# Altium project буй_2_0_AA.PrjPcb
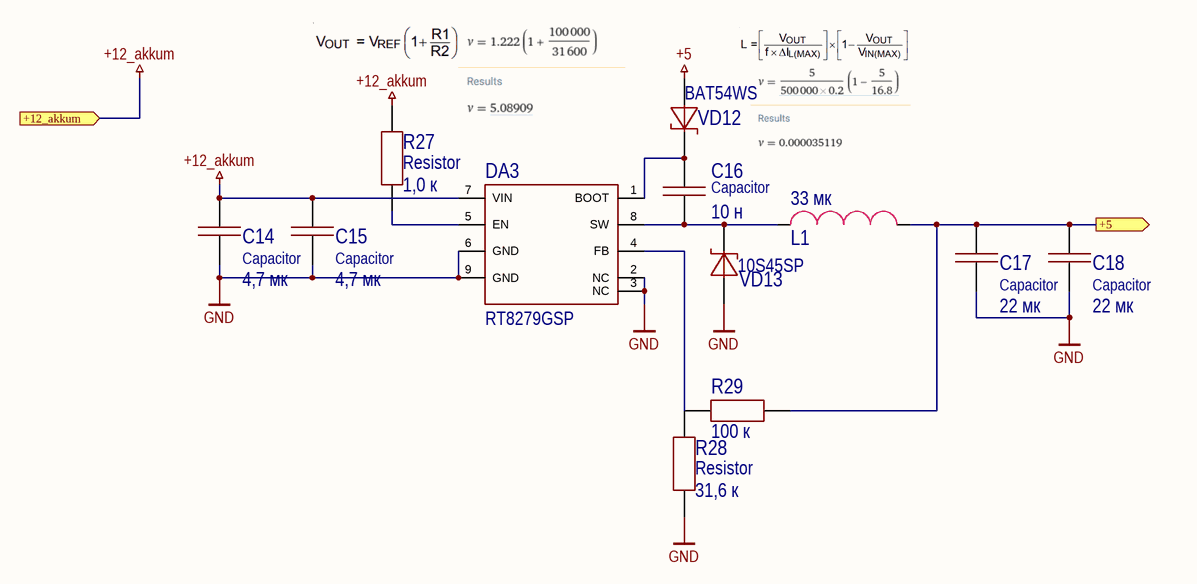
[diagram p0: dcdc5v.SchDoc]
5 sheets, 67 parts. Net scope: flat (ports and power ports of the same name join across sheets).
Board files: áóåêòîïîëãèÿ.PcbDoc, â2áóåêÿèãîëîï.PcbDoc
Sheets:
  dcdc5v.SchDoc
  jarit'_paneli.SchDoc
  switch.SchDoc
  dcdc_na_akkum.SchDoc
  sepic12-12.SchDoc

## Sheet dcdc5v.SchDoc
size A3; Organization: Yandex; Address2: 11 Timura Frunze st., building 2; Release_Date: yyyy-mm-dd; Language: en; Organization2: Self Driving Group LLC

### Parts
C14  Capacitor  value 4,7 мк  [1206C]
C15  Capacitor  value 4,7 мк  [1206C]
C16  Capacitor  value 10 н  [0603C]
C17  Capacitor  value 22 мк  [1210C]
C18  Capacitor  value 22 мк  [1210C]
DA3  RT8279GSP  [8SOP(Exposed_Pad)]
L1  value 33 мк  [IHLP-4040]  (hidden comment: IHLP4040DZER330M11)
R27  Resistor  value 1,0 к  [0603R]
R28  Resistor  value 31,6 к  [0603R]
R29  value 100 к  [0603R]  (hidden comment: Resistor)
VD12  BAT54WS  [SOD-323]
VD13  10S45SP  [TO-277]

### Ports
+5 (out), +12_akkum (in)

### Nets
+5: VD12.1
+12_akkum: C14.2 C15.2 DA3.7(VIN) R27.2 ; port +12_akkum
GND: C14.1 C15.1 C17.1 C18.1 DA3.2(NC) DA3.3(NC) DA3.6(GND) DA3.9(GND) R28.1 VD13.1
NetC16_1: C16.1 DA3.8(SW) L1.1 VD13.2
NetC16_2: C16.2 DA3.1(BOOT) VD12.2
NetC17_2: C17.2 C18.2 L1.2 R29.2 ; port +5
NetDA3_4: DA3.4(FB) R28.2 R29.1
NetDA3_5: DA3.5(EN) R27.1

### Notes on the sheet
- 1
- 2
- 3
- 4
- 5
- 6
- 7
- 8
- A
- B
- C
- D
- E
- Responsible department
- Technical reference
- Document type
- Document status
- F
- Legal owner
- Created by
- Schematic drawing
- Title, Supplementary title
- CONFIDENTIAL
- Yandex
- Commercial secret
- Self Driving Group LLC
- Approved by
- Doc Rev.
- Date of Issue
- Lang.
- Sheet
- A3

### Library data of the parts
C14 C15 = Capacitor_4,7u_10_50V_X7R_1206C: Конденсатор; Tolerance: 0,1; Voltage (V): 50; Dielectric: X7R; Capacity (nF): 4700; Part Number: Capacitor_4,7u_10_50V_X7R_1206C
C16 = Capacitor_10n_10_50V_X7R_0603C: Конденсатор; Tolerance: 0,1; Voltage (V): 50; Dielectric: X7R; Capacity (nF): 10; Part Number: Capacitor_10n_10_50V_X7R_0603C
C17 C18 = Capacitor_22u_10_25V_X7R_1210C: Конденсатор; Tolerance: 0,1; Voltage (V): 25; Dielectric: X7R; Capacity (nF): 22000; Part Number: Capacitor_22u_10_25V_X7R_1210C
DA3 = RT8279GSP: Преобразователь постоянного тока понижающий подстраиваемый выход 5А; Part Number: RT8279GSP
L1 = IHLP4040DZER330M11: ЧИП-индуктивность экранированная 33мкГн ±20% 4,4A 94,5мОм 4040; Inductance (μH): 33; Current (A): 4,4; Part Number: IHLP4040DZER330M11
R27 = Resistor_1.0k_1_0603: Резистор номиналом 1,0 кОм и точностью 1%; Power: *; Part Number: Resistor_1.0k_1_0603; Tolerance: 1%
R28 = Resistor_31.6k_1_0603: Резистор номиналом 31,6 кОм и точностью 1%; Power: *; Part Number: Resistor_31.6k_1_0603; Tolerance: 1%
R29 = Resistor_100k_1_0603: Резистор номиналом 100 кОм и точностью 1%; Power: *; Part Number: Resistor_100k_1_0603; Tolerance: 1%
VD12 = BAT54WS: Диод шоттки на 30 В, ном. ток 0.2 А; Voltage nominal (V): 30; Current (A): 0.2; Part Number: BAT54WS
VD13 = 10S45SP: Диод шоттки на 45 В, ном. ток 10 А; Voltage nominal (V): 45; Current (A): 10; Part Number: 10S45SP

## Sheet jarit'_paneli.SchDoc
size A3; Organization: Yandex; Address2: 11 Timura Frunze st., building 2; Release_Date: yyyy-mm-dd; Language: en; Organization2: Self Driving Group LLC
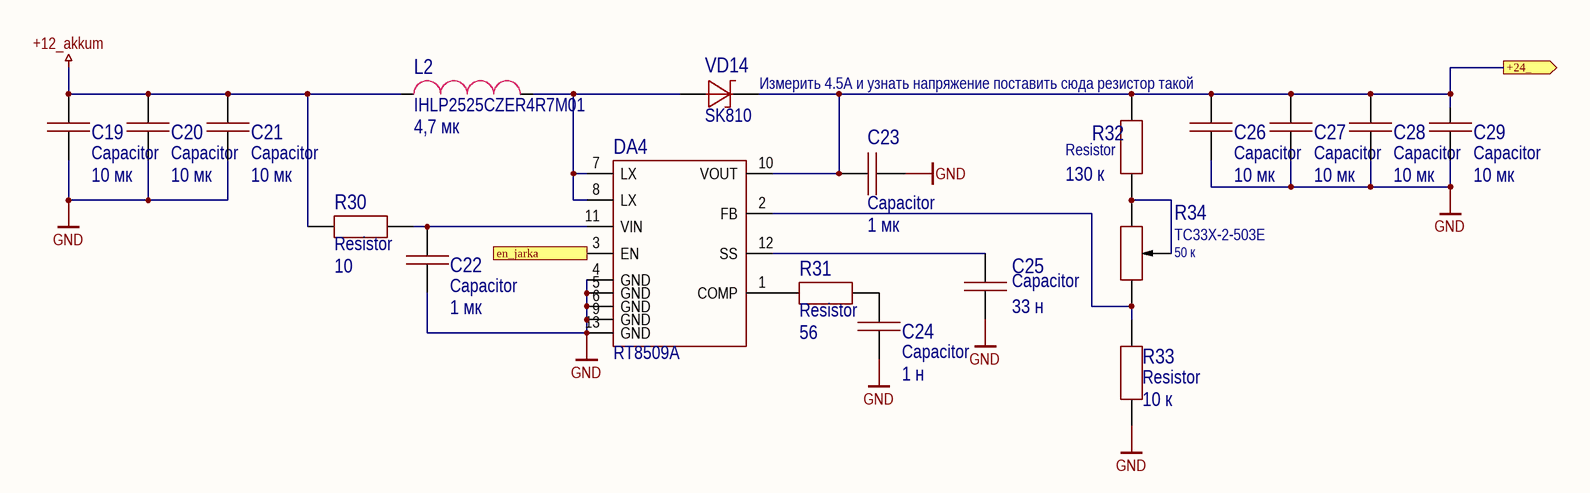
[diagram p1: jarit'_paneli.SchDoc]

### Parts
C19  Capacitor  value 10 мк  [1210C]
C20  Capacitor  value 10 мк  [1210C]
C21  Capacitor  value 10 мк  [1210C]
C22  Capacitor  value 1 мк  [0603C]
C23  Capacitor  value 1 мк  [0603C]
C24  Capacitor  value 1 н  [0603C]
C25  Capacitor  value 33 н  [0603C]
C26  Capacitor  value 10 мк  [1210C]
C27  Capacitor  value 10 мк  [1210C]
C28  Capacitor  value 10 мк  [1210C]
C29  Capacitor  value 10 мк  [1210C]
DA4  RT8509A  [WDFN5x5-12]
L2  IHLP2525CZER4R7M01  value 4,7 мк  [IHLP-2525]
R30  Resistor  value 10  [0603R]
R31  Resistor  value 56  [0603R]
R32  Resistor  value 130 к  [0603R]
R33  Resistor  value 10 к  [0603R]
R34  TC33X-2-503E  value 50 к  [3mm_trim]
VD14  SK810  [SMC]

### Ports
+24_ (out), en_jarka (in)

### Nets
+12_akkum: C19.2 C20.2 C21.2 L2.1 R30.2
GND: C19.1 C20.1 C21.1 C22.1 C23.2 C24.1 C25.2 C26.1 C27.1 C28.1 C29.1 DA4.4(GND) DA4.5(GND) DA4.6(GND) DA4.9(GND) DA4.13(GND) R33.2
NetC22_2: C22.2 DA4.11(VIN) R30.1
NetC23_1: C23.1 C26.2 C27.2 C28.2 C29.2 DA4.10(VOUT) R32.2 VD14.2 ; port +24_
NetC24_2: C24.2 R31.2
NetC25_1: C25.1 DA4.12(SS)
NetDA4_1: DA4.1(COMP) R31.1
NetDA4_2: DA4.2(FB) R33.1 R34.3
NetDA4_3: DA4.3(EN) ; port en_jarka
NetDA4_7: DA4.7(LX) DA4.8(LX) L2.2 VD14.1
NetR32_1: R32.1 R34.1 R34.2

### Notes on the sheet
- Измерить 4.5А и узнать напряжение поставить сюда резистор такой
- 1
- 2
- 3
- 4
- 5
- 6
- 7
- 8
- A
- B
- C
- D
- E
- Responsible department
- Technical reference
- Document type
- Document status
- F
- Legal owner
- Created by
- Schematic drawing
- Title, Supplementary title
- CONFIDENTIAL
- Yandex
- Commercial secret
- Self Driving Group LLC
- Approved by
- Doc Rev.
- Date of Issue
- Lang.
- Sheet
- A3

### Library data of the parts
C19-C21 C26-C29 = Capacitor_10u_10_35V_X7R_1210C: Конденсатор; Tolerance: 0,1; Voltage (V): 35; Dielectric: X7R; Capacity (nF): 10000; Part Number: Capacitor_10u_10_35V_X7R_1210C
C22 C23 = Capacitor_1u_10_50V_X7R_0603C: Конденсатор; Tolerance: 0,1; Voltage (V): 50; Dielectric: X7R; Capacity (nF): 1000; Part Number: Capacitor_1u_10_50V_X7R_0603C
C24 = Capacitor_1n_10_50V_X7R_0603C: Конденсатор; Tolerance: 0,1; Voltage (V): 50; Dielectric: X7R; Capacity (nF): 1; Part Number: Capacitor_1n_10_50V_X7R_0603C
C25 = Capacitor_33n_10_50V_X7R_0603C: Конденсатор; Tolerance: 0,1; Voltage (V): 50; Dielectric: X7R; Capacity (nF): 33; Part Number: Capacitor_33n_10_50V_X7R_0603C
DA4 = RT8509A: Импульсный повышающий DC-DC стабилизатор, регулируемый, 2.8В-14В (Vin), 24В/4.5A, 1.5МГц, WDFN-12; Part Number: RT8509A
L2 = IHLP2525CZER4R7M01: ЧИП-индуктивность экранированная 4,7мкГн ±20% 5,5A 40мОм 2525; Inductance (μH): 4,7; Current (A): 5,5; Part Number: IHLP2525CZER4R7M01
R30 = Resistor_10_1_0603: Резистор номиналом 10 Ом и точностью 1%; Power: *; Part Number: Resistor_10_1_0603; Tolerance: 1%
R31 = Resistor_56_1_0603: Резистор номиналом 56 Ом и точностью 1%; Power: *; Part Number: Resistor_56_1_0603; Tolerance: 1%
R32 = Resistor_130k_1_0603: Резистор номиналом 130 кОм и точностью 1%; Power: *; Part Number: Resistor_130k_1_0603; Tolerance: 1%
R33 = Resistor_10k_1_0603: Резистор номиналом 10 кОм и точностью 1%; Power: *; Part Number: Resistor_10k_1_0603; Tolerance: 1%
R34 = TC33X-2-503E: Потенциометр однооборотный керметный 50кОм 0.1Вт ±25% SMD лента на катушке; Tolerance: 50%; Part Number: TC33X-2-503E
VD14 = SK810: Диод шоттки на 100 В, ном. ток 8 А; Voltage nominal (V): 100; Current (A): 8; Part Number: SK810

## Sheet switch.SchDoc
size A3; Organization: Yandex; Address2: 11 Timura Frunze st., building 2; Release_Date: yyyy-mm-dd; Language: en; Organization2: Self Driving Group LLC
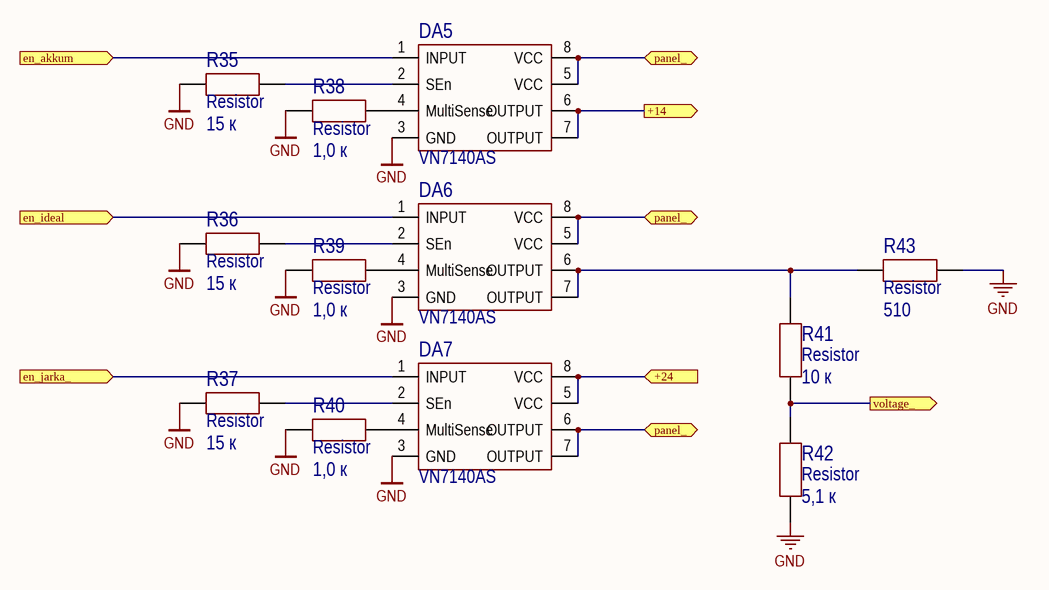
[diagram p2: switch.SchDoc]

### Parts
DA5  VN7140AS  [SOP8]
DA6  VN7140AS  [SOP8]
DA7  VN7140AS  [SOP8]
R35  Resistor  value 15 к  [0603R]
R36  Resistor  value 15 к  [0603R]
R37  Resistor  value 15 к  [0603R]
R38  Resistor  value 1,0 к  [0603R]
R39  Resistor  value 1,0 к  [0603R]
R40  Resistor  value 1,0 к  [0603R]
R41  Resistor  value 10 к  [0603R]
R42  Resistor  value 5,1 к  [0603R]
R43  Resistor  value 510  [2512R]

### Ports
+14 (out), +24 (in), en_akkum (in), en_ideal (in), en_jarka_ (in), panel_ (bidir), voltage_ (out)

### Nets
+14: DA5.6(OUTPUT) DA5.7(OUTPUT) ; port +14
GND: DA5.3(GND) DA6.3(GND) DA7.3(GND) R35.1 R36.1 R37.1 R38.1 R39.1 R40.1 R42.1 R43.2
NetDA5_1: DA5.1(INPUT) ; port en_akkum
NetDA5_2: DA5.2(SEn) R35.2
NetDA5_4: DA5.4(MultiSense) R38.2
NetDA5_5: DA5.5(VCC) DA5.8(VCC) DA6.5(VCC) DA6.8(VCC) DA7.6(OUTPUT) DA7.7(OUTPUT) ; port panel_
NetDA6_1: DA6.1(INPUT) ; port en_ideal
NetDA6_2: DA6.2(SEn) R36.2
NetDA6_4: DA6.4(MultiSense) R39.2
NetDA6_6: DA6.6(OUTPUT) DA6.7(OUTPUT) R41.2 R43.1
NetDA7_1: DA7.1(INPUT) ; port en_jarka_
NetDA7_2: DA7.2(SEn) R37.2
NetDA7_4: DA7.4(MultiSense) R40.2
NetDA7_5: DA7.5(VCC) DA7.8(VCC) ; port +24
NetR41_1: R41.1 R42.2 ; port voltage_

### Notes on the sheet
- 1
- 2
- 3
- 4
- 5
- 6
- 7
- 8
- A
- B
- C
- D
- E
- Responsible department
- Technical reference
- Document type
- Document status
- F
- Legal owner
- Created by
- Schematic drawing
- Title, Supplementary title
- CONFIDENTIAL
- Yandex
- Commercial secret
- Self Driving Group LLC
- Approved by
- Doc Rev.
- Date of Issue
- Lang.
- Sheet
- A3

### Library data of the parts
DA5-DA7 = VN7140AS: Силовой ключ верхнего плеча с аналоговой обратной связью MultiSense автомобильного применения; Part Number: VN7140AS
R35-R37 = Resistor_15k_1_0603: Резистор номиналом 15 кОм и точностью 1%; Power: *; Part Number: Resistor_15k_1_0603; Tolerance: 1%
R38-R40 = Resistor_1.0k_1_0603: as R27 on sheet dcdc5v; Power: *; Part Number: Resistor_1.0k_1_0603; Tolerance: 1%
R41 = Resistor_10k_1_0603: Резистор номиналом 10 кОм и точностью 1%; Power: *; Part Number: Resistor_10k_1_0603; Tolerance: 1%
R42 = Resistor_5.1k_1_0603: Резистор номиналом 5,1 кОм и точностью 1%; Power: *; Part Number: Resistor_5.1k_1_0603; Tolerance: 1%
R43 = Resistor_510_1_0603: Резистор номиналом 510 Ом и точностью 1%; Power: *; Part Number: Resistor_510_1_0603; Tolerance: 1%

## Sheet dcdc_na_akkum.SchDoc
size A3; Organization: Yandex; Address2: 11 Timura Frunze st., building 2; Release_Date: yyyy-mm-dd; Language: en; Organization2: Self Driving Group LLC
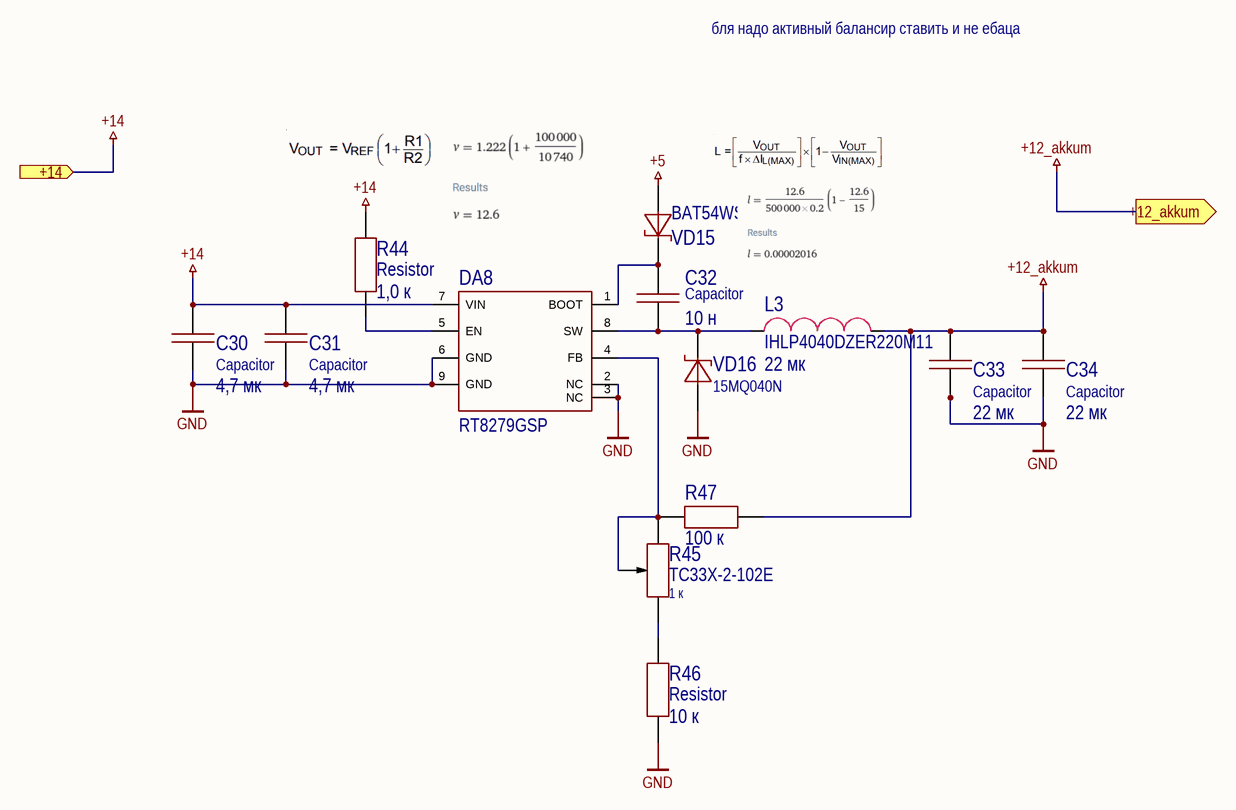
[diagram p3: dcdc_na_akkum.SchDoc]

### Parts
C30  Capacitor  value 4,7 мк  [1206C]
C31  Capacitor  value 4,7 мк  [1206C]
C32  Capacitor  value 10 н  [0603C]
C33  Capacitor  value 22 мк  [1210C]
C34  Capacitor  value 22 мк  [1210C]
DA8  RT8279GSP  [8SOP(Exposed_Pad)]
L3  IHLP4040DZER220M11  value 22 мк  [IHLP-4040]
R44  Resistor  value 1,0 к  [0603R]
R45  TC33X-2-102E  value 1 к  [3mm_trim]
R46  Resistor  value 10 к  [0603R]
R47  value 100 к  [0603R]  (hidden comment: Resistor)
VD15  BAT54WS  [SOD-323]
VD16  15MQ040N  [SMA]

### Ports
+12_akkum (out), +14 (in)

### Nets
+5: VD15.1
+12_akkum: C33.2 C34.2 L3.2 R47.2 ; port +12_akkum
+14: C30.2 C31.2 DA8.7(VIN) R44.2 ; port +14
GND: C30.1 C31.1 C33.1 C34.1 DA8.2(NC) DA8.3(NC) DA8.6(GND) DA8.9(GND) R46.1 VD16.1
NetC32_1: C32.1 DA8.8(SW) L3.1 VD16.2
NetC32_2: C32.2 DA8.1(BOOT) VD15.2
NetDA8_4: DA8.4(FB) R45.2 R45.3 R47.1
NetDA8_5: DA8.5(EN) R44.1
NetR45_1: R45.1 R46.2

### Notes on the sheet
- бля надо активный балансир ставить и не ебаца
- 1
- 2
- 3
- 4
- 5
- 6
- 7
- 8
- A
- B
- C
- D
- E
- Responsible department
- Technical reference
- Document type
- Document status
- F
- Legal owner
- Created by
- Schematic drawing
- Title, Supplementary title
- CONFIDENTIAL
- Yandex
- Commercial secret
- Self Driving Group LLC
- Approved by
- Doc Rev.
- Date of Issue
- Lang.
- Sheet
- A3

### Library data of the parts
C30 C31 = Capacitor_4,7u_10_50V_X7R_1206C: as C14 on sheet dcdc5v; Part Number: Capacitor_4,7u_10_50V_X7R_1206C
C32 = Capacitor_10n_10_50V_X7R_0603C: as C16 on sheet dcdc5v; Part Number: Capacitor_10n_10_50V_X7R_0603C
C33 C34 = Capacitor_22u_10_25V_X7R_1210C: as C17 on sheet dcdc5v; Part Number: Capacitor_22u_10_25V_X7R_1210C
DA8 = RT8279GSP: as DA3 on sheet dcdc5v; Part Number: RT8279GSP
L3 = IHLP4040DZER220M11: ЧИП-индуктивность экранированная 22мкГн ±20% 5A 66мОм 4040 лента на катушке; Inductance (μH): 22; Current (A): 5; Part Number: IHLP4040DZER220M11
R44 = Resistor_1.0k_1_0603: as R27 on sheet dcdc5v; Power: *; Part Number: Resistor_1.0k_1_0603; Tolerance: 1%
R45 = TC33X-2-102E: Потенциометр керметный 1кОм 0.1Вт для поверхностного монтажа; Tolerance: 50%; Part Number: TC33X-2-102E
R46 = Resistor_10k_1_0603: Резистор номиналом 10 кОм и точностью 1%; Power: *; Part Number: Resistor_10k_1_0603; Tolerance: 1%
R47 = Resistor_100k_1_0603: as R29 on sheet dcdc5v; Power: *; Part Number: Resistor_100k_1_0603; Tolerance: 1%
VD15 = BAT54WS: as VD12 on sheet dcdc5v; Part Number: BAT54WS
VD16 = 15MQ040N: Диод шоттки на 40 В, ном. ток 2.1 А; Voltage nominal (V): 40; Current (A): 2.1; Part Number: 15MQ040N

## Sheet sepic12-12.SchDoc
size A3; Organization: Yandex; Address2: 11 Timura Frunze st., building 2; Release_Date: yyyy-mm-dd; Language: en; Organization2: Self Driving Group LLC
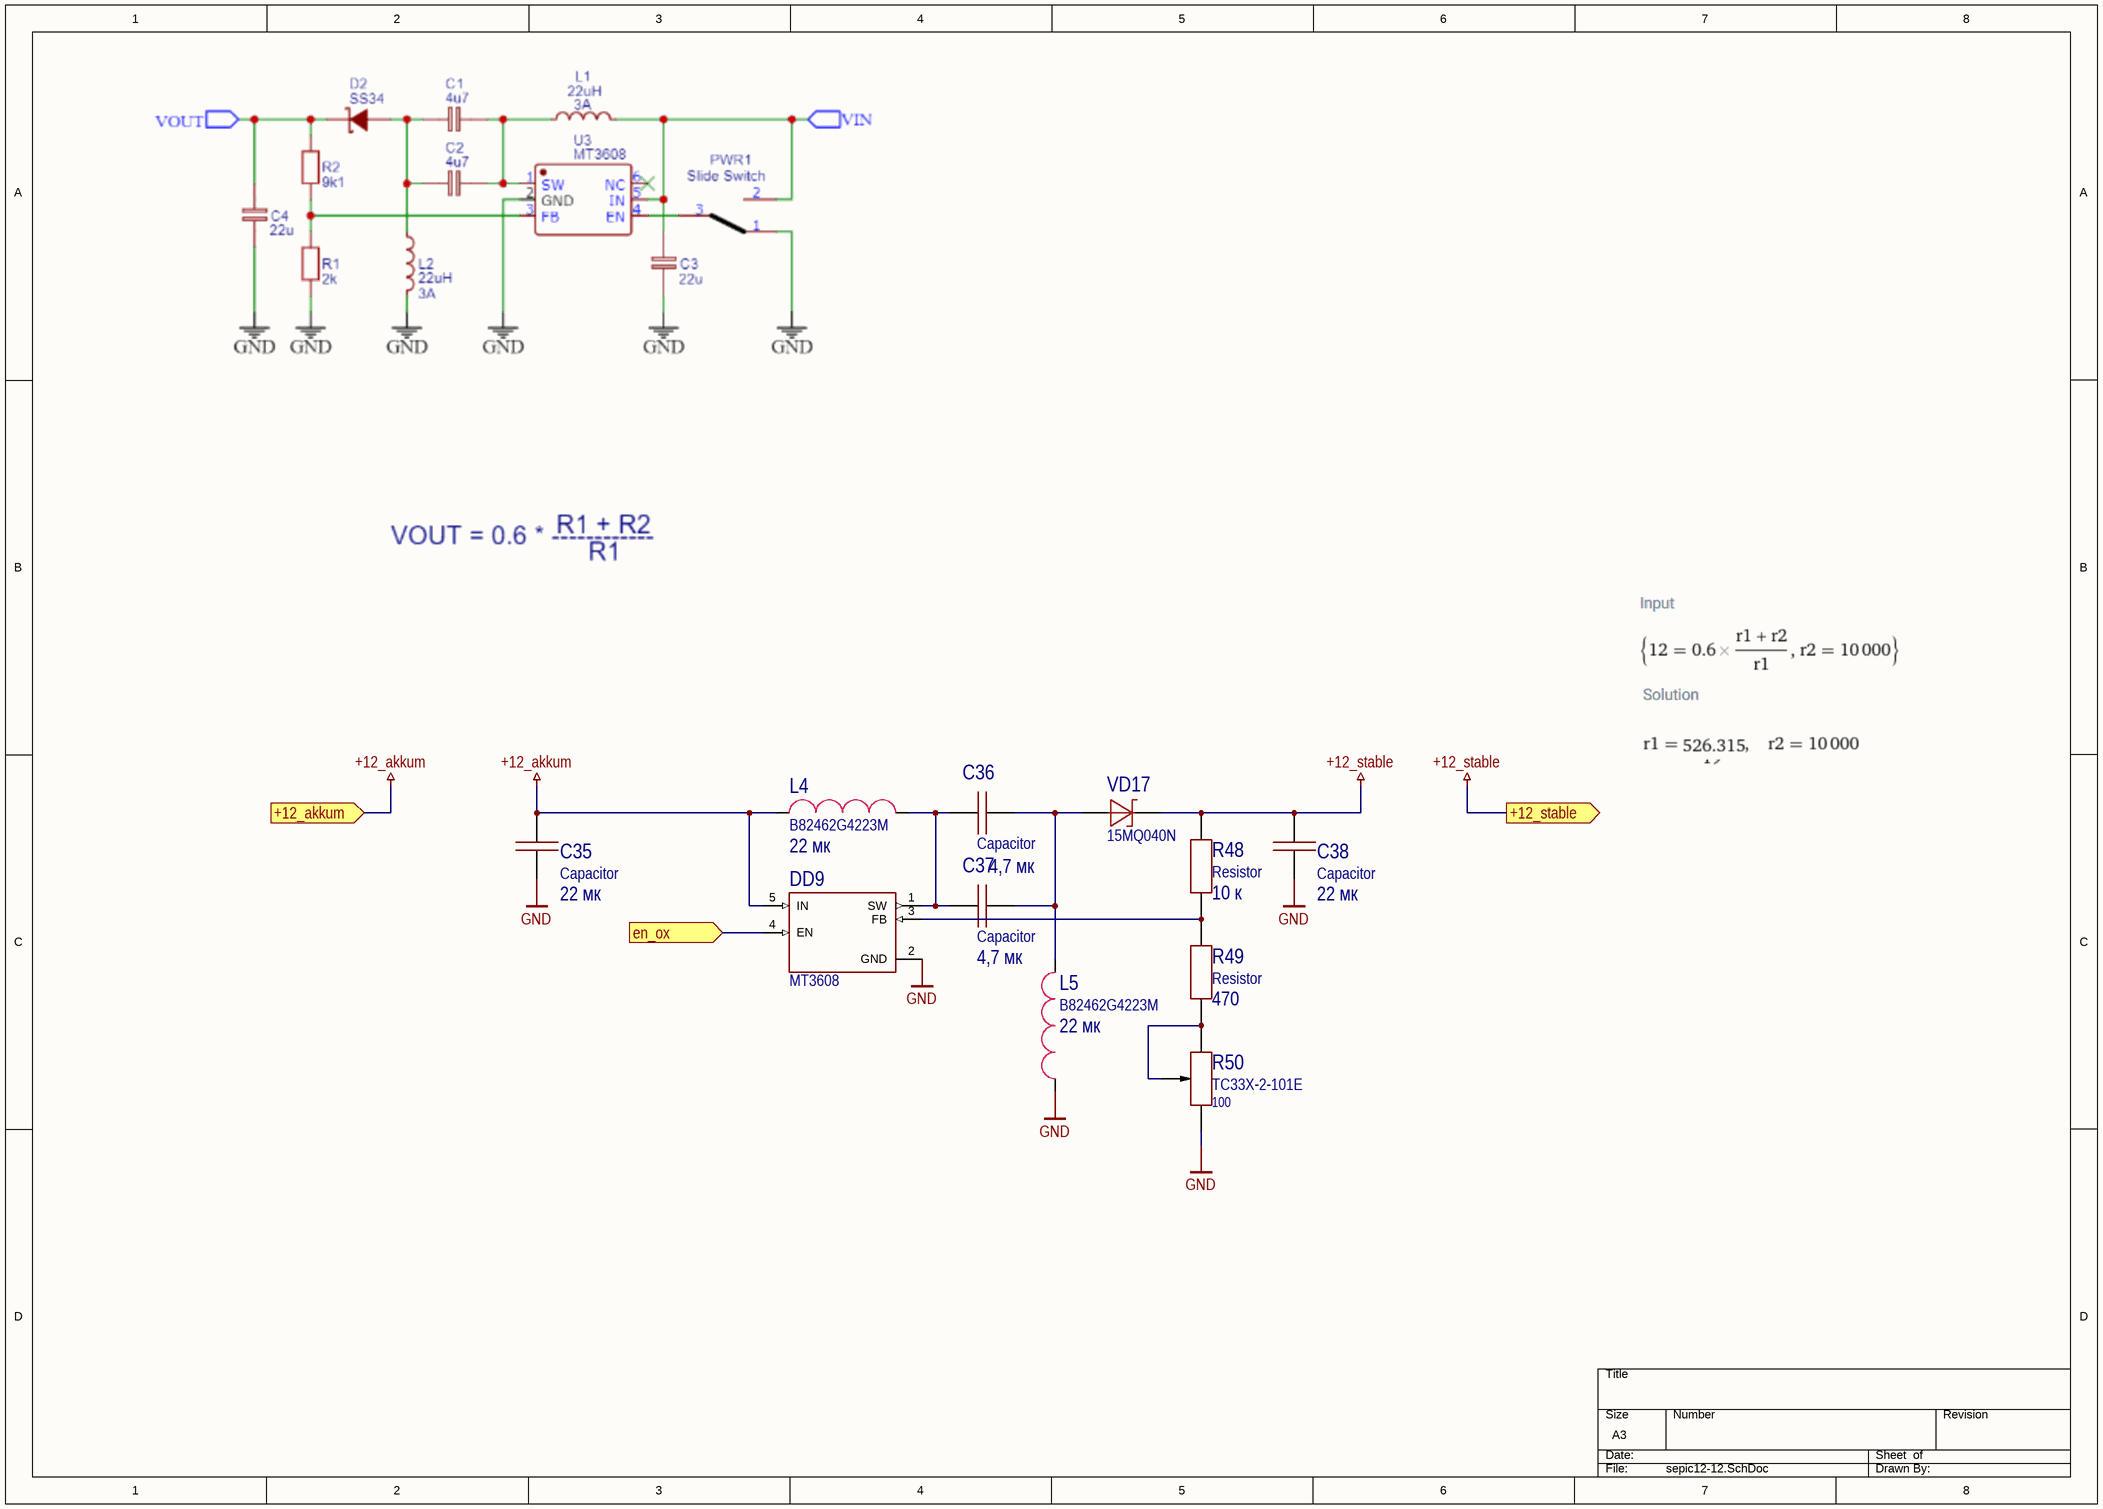
[diagram p4: sepic12-12.SchDoc]

### Parts
C35  Capacitor  value 22 мк  [1210C]
C36  Capacitor  value 4,7 мк  [1206C]
C37  Capacitor  value 4,7 мк  [1206C]
C38  Capacitor  value 22 мк  [1210C]
DD9  MT3608  [SOT23-6]
L4  B82462G4223M  value 22 мк  [B82462G4]
L5  B82462G4223M  value 22 мк  [B82462G4]
R48  Resistor  value 10 к  [0603R]
R49  Resistor  value 470  [0603R]
R50  TC33X-2-101E  value 100  [3mm_trim]
VD17  15MQ040N  [SMA]

### Ports
+12_akkum (in), +12_stable (out), en_ox (in)

### Nets
+12_akkum: C35.2 DD9.5(IN) L4.1 ; port +12_akkum
+12_stable: C38.2 R48.2 VD17.2 ; port +12_stable
GND: C35.1 C38.1 DD9.2(GND) L5.1 R50.1
NetC36_1: C36.1 C37.1 DD9.1(SW) L4.2
NetC36_2: C36.2 C37.2 L5.2 VD17.1
NetDD9_3: DD9.3(FB) R48.1 R49.2
NetDD9_4: DD9.4(EN) ; port en_ox
NetR49_1: R49.1 R50.2 R50.3

### Notes on the sheet
- 1
- 2
- 3
- 4
- 5
- 6
- 7
- 8
- A
- B
- C
- D
- E
- Responsible department
- Technical reference
- Document type
- Document status
- F
- Legal owner
- Created by
- Schematic drawing
- Title, Supplementary title
- CONFIDENTIAL
- Yandex
- Commercial secret
- Self Driving Group LLC
- Approved by
- Doc Rev.
- Date of Issue
- Lang.
- Sheet
- A3

### Library data of the parts
C35 C38 = Capacitor_22u_10_25V_X7R_1210C: as C17 on sheet dcdc5v; Part Number: Capacitor_22u_10_25V_X7R_1210C
C36 C37 = Capacitor_4,7u_10_50V_X7R_1206C: as C14 on sheet dcdc5v; Part Number: Capacitor_4,7u_10_50V_X7R_1206C
DD9 = MT3608: Повышающий/SEPIC DC-DC преобразователь 2А 1.2МГц; Part Number: MT3608
L4 L5 = B82462G4223M: ЧИП-индуктивность 22мкГн, 1.05A, ±20% катушка; Inductance (μH): 22; Current (A): 1.05; Part Number: B82462G4223M
R48 = Resistor_10k_1_0603: Резистор номиналом 10 кОм и точностью 1%; Power: *; Part Number: Resistor_10k_1_0603; Tolerance: 1%
R49 = Resistor_470_1_0603: Резистор номиналом 470 Ом и точностью 1%; Power: *; Part Number: Resistor_470_1_0603; Tolerance: 1%
R50 = TC33X-2-101E: Потенциометр керметный 100 Ом 0.1Вт для поверхностного монтажа; Tolerance: 50%; Part Number: TC33X-2-101E
VD17 = 15MQ040N: as VD16 on sheet dcdc_na_akkum; Part Number: 15MQ040N

## Nets that join several sheets
+5: dcdc5v (VD12.1), dcdc_na_akkum (VD15.1)
+12_akkum: dcdc5v (C14.2 C15.2 DA3.7 R27.2), jarit'_paneli (5 pins), dcdc_na_akkum (C33.2 C34.2 L3.2 R47.2), sepic12-12 (C35.2 DD9.5 L4.1)
+14: switch (DA5.6 DA5.7), dcdc_na_akkum (C30.2 C31.2 DA8.7 R44.2)
GND: dcdc5v (10 pins), jarit'_paneli (17 pins), switch (11 pins), dcdc_na_akkum (10 pins), sepic12-12 (5 pins)

## Assembly variants
default: not fitted C4 D1 DD1 R1